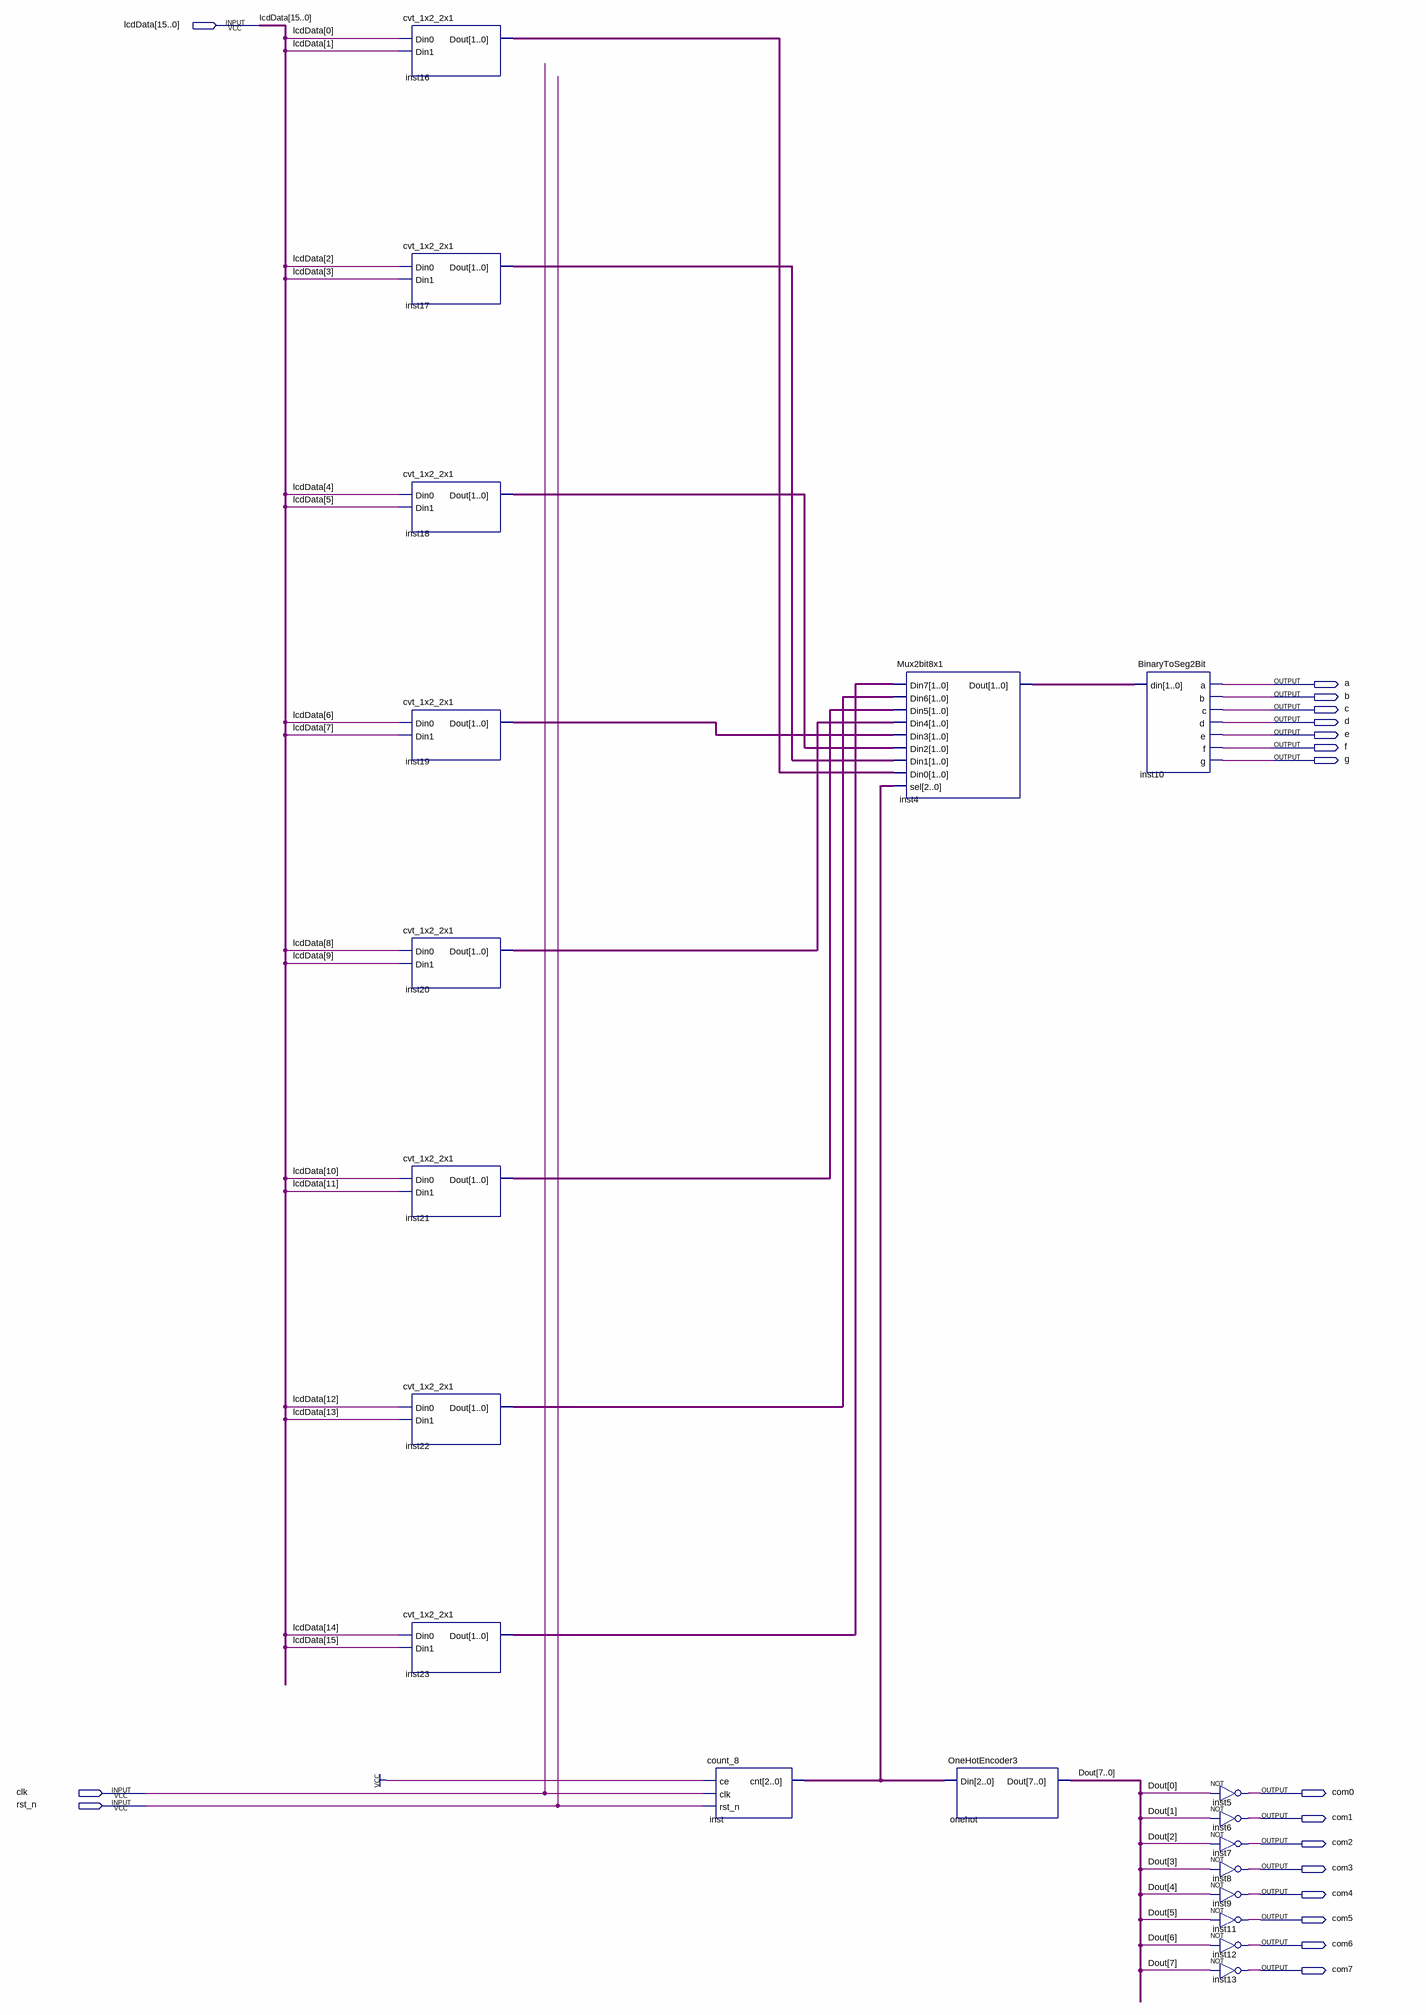
[diagram p0: schematic sheet]
// Quartus schematic SegDisplay.bdf as structural Verilog: 20 symbols, 18 pins
module SegDisplay (
  input  [15:0] lcdData,
  input  clk,
  input  rst_n,
  output a,
  output b,
  output c,
  output d,
  output e,
  output f,
  output g,
  output com0,
  output com1,
  output com2,
  output com3,
  output com4,
  output com5,
  output com6,
  output com7
);

  wire [1:0] inst4_dout, inst16_dout, inst17_dout, inst18_dout, inst19_dout, inst20_dout, inst21_dout,
       inst22_dout, inst23_dout;
  wire [2:0] inst_cnt;
  wire [7:0] Dout;

  cvt_1x2_2x1 inst16 (.Din0(lcdData[0]), .Din1(lcdData[1]), .Dout(inst16_dout));
  cvt_1x2_2x1 inst17 (.Din0(lcdData[2]), .Din1(lcdData[3]), .Dout(inst17_dout));
  cvt_1x2_2x1 inst18 (.Din0(lcdData[4]), .Din1(lcdData[5]), .Dout(inst18_dout));
  cvt_1x2_2x1 inst19 (.Din0(lcdData[6]), .Din1(lcdData[7]), .Dout(inst19_dout));
  cvt_1x2_2x1 inst20 (.Din0(lcdData[8]), .Din1(lcdData[9]), .Dout(inst20_dout));
  cvt_1x2_2x1 inst21 (.Din0(lcdData[10]), .Din1(lcdData[11]), .Dout(inst21_dout));
  cvt_1x2_2x1 inst22 (.Din0(lcdData[12]), .Din1(lcdData[13]), .Dout(inst22_dout));
  cvt_1x2_2x1 inst23 (.Din0(lcdData[14]), .Din1(lcdData[15]), .Dout(inst23_dout));
  count_8 inst (.ce(1'b1), .clk(clk), .rst_n(rst_n), .cnt(inst_cnt));
  Mux2bit8x1 inst4 (
    .Din7(inst23_dout), .Din6(inst22_dout), .Din5(inst21_dout), .Din4(inst20_dout), .Din3(inst19_dout),
    .Din2(inst18_dout), .Din1(inst17_dout), .Din0(inst16_dout), .sel(inst_cnt), .Dout(inst4_dout));
  OneHotEncoder3 onehot (.Din(inst_cnt), .Dout(Dout));
  BinaryToSeg2Bit inst10 (.din(inst4_dout), .a(a), .b(b), .c(c), .d(d), .e(e), .f(f), .g(g));
  not inst5 (com0, Dout[0]);
  not inst6 (com1, Dout[1]);
  not inst7 (com2, Dout[2]);
  not inst8 (com3, Dout[3]);
  not inst9 (com4, Dout[4]);
  not inst11 (com5, Dout[5]);
  not inst12 (com6, Dout[6]);
  not inst13 (com7, Dout[7]);
endmodule
